# EAGLE design usb-serial-socket (EAGLE 8.3.1)
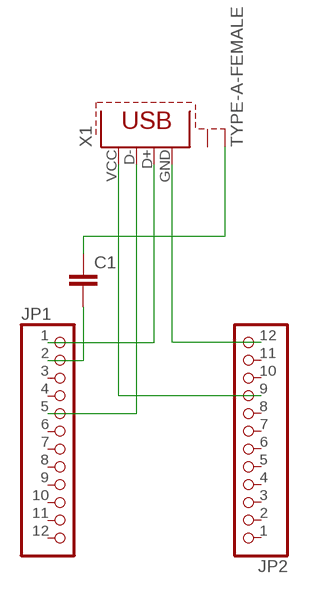
[diagram p0: schematic, sheet 1]

## Parts
C1  C-EU025-024X044  [C025-024X044]
JP1  PINHD-1X12  [1X12]
JP2  PINHD-1X12  [1X12]
X1  TYPE-A-FEMALE  [TYPE-A-FEMALE]

## Nets
N$1: JP1.1 X1.D+
N$2: JP1.5 X1.D-
N$3: C1.1 X1.S2
N$4: JP2.12 X1.GND
N$5: JP2.9 X1.VCC
N$7: C1.2 JP1.2
Unconnected: JP1.3 JP1.4 JP1.6 JP1.7 JP1.8 JP1.9 JP1.10 JP1.11 JP1.12 JP2.1 JP2.2 JP2.3 JP2.4 JP2.5 JP2.6 JP2.7 JP2.8 JP2.10 JP2.11 X1.S1

## Library data of the parts
C1 = rcl:C-EU: CAPACITOR, European symbol
JP1 JP2 = pinhead:PINHD-1X12: PIN HEADER
X1 = usb-connector:TYPE-A-FEMALE; OC_FARNELL: unknown; OC_NEWARK: unknown

## Board
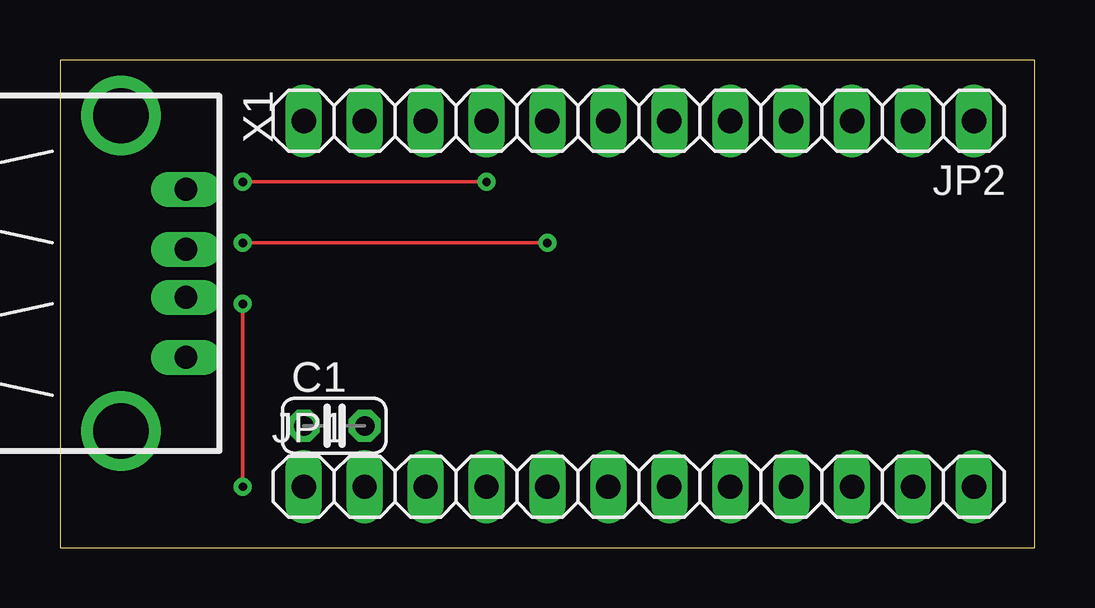
[diagram p1: board, top side]
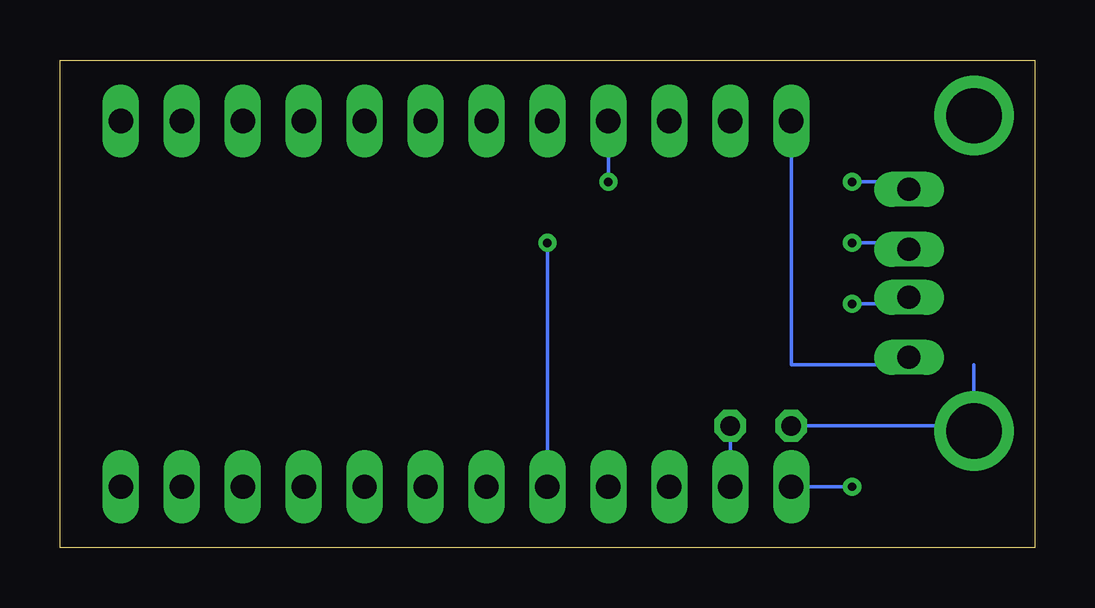
[diagram p2: board, bottom side, seen from below]

Size 40.64 x 20.32 mm. Coordinates in mm from the lower left corner, seen from the top.
Outline: 0,0 40.64,0 40.64,20.32 0,20.32 0,0
Copper layers (1*16): Top 0.035mm / dielectric 1.5mm / Bottom 0.035mm
Design rules "default": minimum track width 6mil, minimum drill 0.35mm, track to track 6mil, track to pad 6mil, pad to pad 6mil, via to via 6mil, smd to smd 6mil, copper to edge 40mil, drill to drill 6mil, minimum pad ring 10mil, minimum via ring 8mil, stop-mask expansion 4mil, vias tented up to drill 0mil, thermal gap 10mil

### Footprints (pad centres in the part's own frame; a part is rotated, then mirrored left to right if it is on the bottom)
C025-024X044 = drill 0.813 octagon: 1 -1.27,0; 2 1.27,0
1X12 = drill 1.016 long: 1 -13.97,0; 2 -11.43,0; 3 -8.89,0; 4 -6.35,0; 5 -3.81,0; 6 -1.27,0; 7 1.27,0; 8 3.81,0; 9 6.35,0; 10 8.89,0; 11 11.43,0; 12 13.97,0
TYPE-A-FEMALE = drill 0.95 long: D+ 1,2.71; D- -1,2.71; GND 3.5,2.71; VCC -3.5,2.71 | drill 2.3 pad 2.9: S1 -6.57,0; S2 6.57,0

### Placement (x,y rotation side)
C1  11.43,5.08 0 top
JP1  24.13,2.54 0 top
JP2  24.13,17.78 180 top
X1  2.54,11.43 270 top

### Tracks (layer width: path | path; a pad name or v marks a point on that pad's centre or on a via)
N$1  (via drill 0.35)
  Top 0.152: v7.62,2.54 v7.62,10.16
  Bottom 0.152: JP1.1 v7.62,2.54 | v7.62,10.16 5.08,10.16 5.08,10.26 X1.D+
N$2  (via drill 0.35)
  Top 0.152: v20.32,12.7 v7.62,12.7
  Bottom 0.152: JP1.5 v20.32,12.7 | v7.62,12.7 5.08,12.7 5.08,12.6 X1.D-
N$3
  Bottom 0.152: C1.1 2.76,5.08 X1.S2
N$4
  Bottom 0.152: JP2.12 10.16,7.62 5.08,7.62 5.08,7.76 X1.GND
N$5  (via drill 0.35)
  Top 0.152: v7.62,15.24 v17.78,15.24
  Bottom 0.152: X1.VCC 5.08,15.24 v7.62,15.24 | v17.78,15.24 JP2.9
N$6
  Bottom 0.152: 2.54,5.08 2.54,7.62
N$7
  Bottom 0.152: JP1.2 C1.2